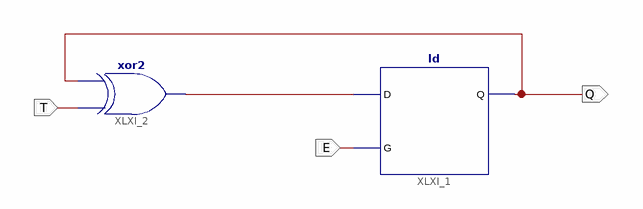
[diagram p0: schematic sheet 1]
// Xilinx ISE schematic latch_T.sch (artix7) as structural Verilog: 2 symbols, 3 ports
module latch_T (
  input  T,
  input  E,
  output Q
);

  wire XLXN_4;

  ld #(.INIT("0")) XLXI_1 (.D(XLXN_4), .G(E), .Q(Q));
  xor XLXI_2 (XLXN_4, T, Q);
endmodule
